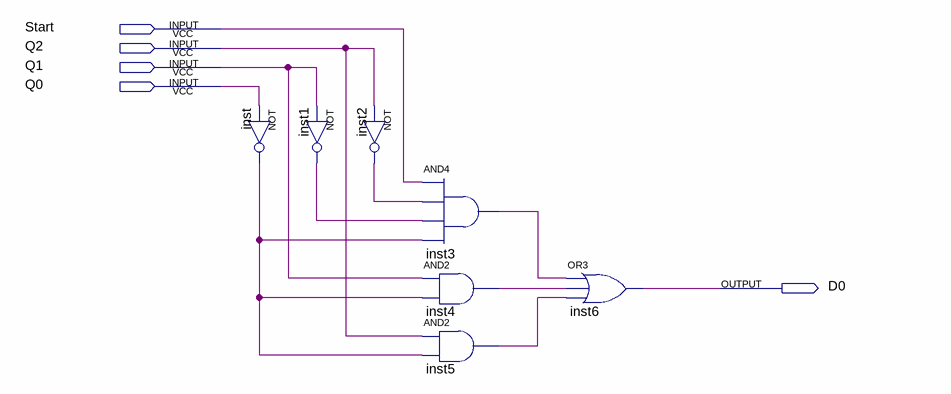
[diagram p0: schematic sheet]
// Quartus schematic D0.bdf as structural Verilog: 7 symbols, 5 pins
module D0 (
  input  Start,
  input  Q2,
  input  Q1,
  input  Q0,
  output D0
);

  wire inst1_out, inst2_out, inst3_out, inst4_out, inst5_out, inst_out;

  not inst (inst_out, Q0);
  not inst1 (inst1_out, Q1);
  not inst2 (inst2_out, Q2);
  and inst3 (inst3_out, Start, inst2_out, inst1_out, inst_out);
  and inst4 (inst4_out, Q1, inst_out);
  and inst5 (inst5_out, Q2, inst_out);
  or inst6 (D0, inst3_out, inst4_out, inst5_out);
endmodule
